# Altium schematic sheet TOP.SchDoc
size A4; SheetNumber: 1; SheetTotal: 9
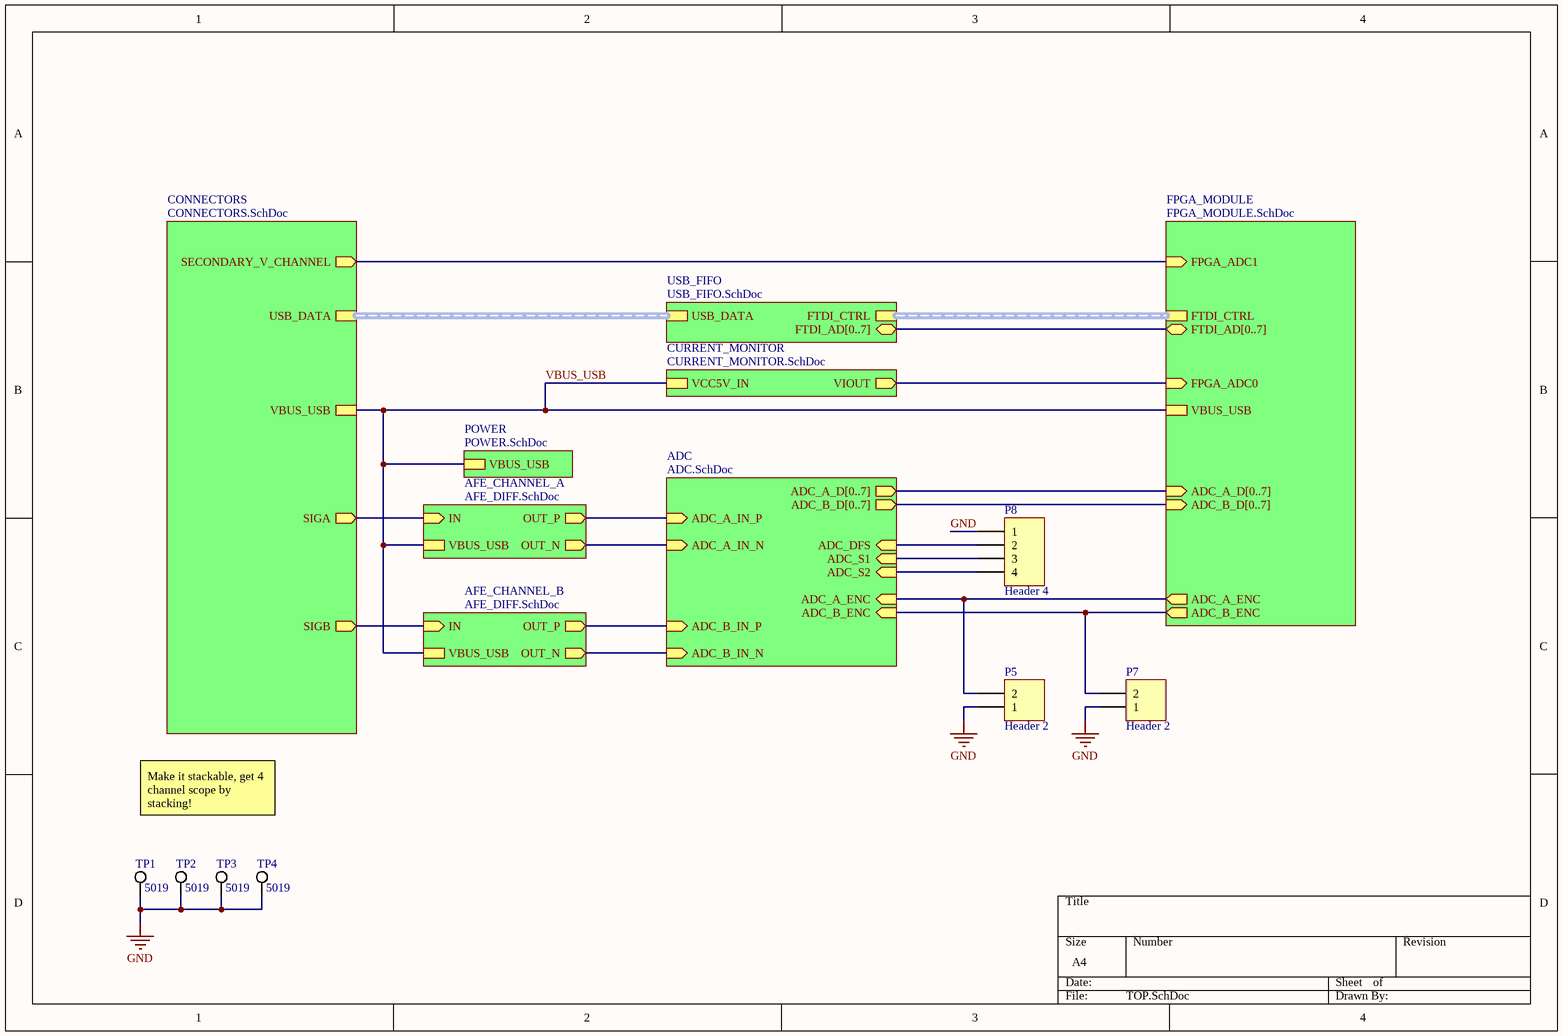
[diagram p0: TOP.SchDoc]

## Parts
P5  Header 2  [HDR1X2]
P7  Header 2  [HDR1X2]
P8  Header 4  [HDR1X4]
TP1  5019  [KSTN-5019_V]
TP2  5019  [KSTN-5019_V]
TP3  5019  [KSTN-5019_V]
TP4  5019  [KSTN-5019_V]

## Sub-sheets
ADC = ADC.SchDoc: ADC_A_IN_P (in), ADC_A_D[0..7] (out), ADC_A_ENC (in), ADC_B_IN_P (in), ADC_B_ENC (in), ADC_DFS (in), ADC_S1 (in), ADC_S2 (in), ADC_B_D[0..7] (out), ADC_A_IN_N (in), ADC_B_IN_N (in)
AFE_CHANNEL_A = AFE_DIFF.SchDoc: IN (in), OUT_P (out), OUT_N (out), VBUS_USB
AFE_CHANNEL_B = AFE_DIFF.SchDoc: IN (in), OUT_P (out), OUT_N (out), VBUS_USB
CONNECTORS = CONNECTORS.SchDoc: USB_DATA (harness USB_DATA), VBUS_USB, SIGA (out), SECONDARY_V_CHANNEL (out), SIGB (out)
CURRENT_MONITOR = CURRENT_MONITOR.SchDoc: VIOUT (out), VCC5V_IN
FPGA_MODULE = FPGA_MODULE.SchDoc: FTDI_CTRL (harness FTDI_CTRL), FTDI_AD[0..7] (bidir), VBUS_USB, ADC_A_D[0..7] (in), ADC_A_ENC (out), FPGA_ADC0 (in), FPGA_ADC1 (in), ADC_B_ENC (out), ADC_B_D[0..7] (in)
POWER = POWER.SchDoc: VBUS_USB
USB_FIFO = USB_FIFO.SchDoc: USB_DATA (harness USB_DATA), FTDI_CTRL (harness FTDI_CTRL), FTDI_AD[0..7] (bidir)

## Nets
GND: P5.1 P7.1 P8.1 TP1.1 TP2.1 TP3.1 TP4.1
VBUS_USB: sheet FPGA_MODULE/VBUS_USB, sheet CONNECTORS/VBUS_USB, sheet POWER/VBUS_USB, sheet AFE_CHANNEL_A/VBUS_USB, sheet CURRENT_MONITOR/VCC5V_IN, sheet AFE_CHANNEL_B/VBUS_USB
NetP5_2: P5.2 ; sheet FPGA_MODULE/ADC_A_ENC, sheet ADC/ADC_A_ENC
NetP7_2: P7.2 ; sheet FPGA_MODULE/ADC_B_ENC, sheet ADC/ADC_B_ENC
NetP8_2: P8.2 ; sheet ADC/ADC_DFS
NetP8_3: P8.3 ; sheet ADC/ADC_S1
NetP8_4: P8.4 ; sheet ADC/ADC_S2
(unnamed): sheet FPGA_MODULE/FPGA_ADC0, sheet CURRENT_MONITOR/VIOUT
(unnamed): sheet FPGA_MODULE/FPGA_ADC1, sheet CONNECTORS/SECONDARY_V_CHANNEL
(unnamed): sheet CONNECTORS/SIGA, sheet AFE_CHANNEL_A/IN
(unnamed): sheet CONNECTORS/SIGB, sheet AFE_CHANNEL_B/IN
(unnamed): sheet ADC/ADC_A_IN_P, sheet AFE_CHANNEL_A/OUT_P
(unnamed): sheet ADC/ADC_B_IN_P, sheet AFE_CHANNEL_B/OUT_P
(unnamed): sheet ADC/ADC_A_IN_N, sheet AFE_CHANNEL_A/OUT_N
(unnamed): sheet ADC/ADC_B_IN_N, sheet AFE_CHANNEL_B/OUT_N

## Buses and harness runs
bus sheet ADC/ADC_A_D[0..7] = sheet FPGA_MODULE/ADC_A_D[0..7]
bus sheet ADC/ADC_B_D[0..7] = sheet FPGA_MODULE/ADC_B_D[0..7]
bus sheet FPGA_MODULE/FTDI_AD[0..7] = sheet USB_FIFO/FTDI_AD[0..7]
harness sheet CONNECTORS/USB_DATA = sheet USB_FIFO/USB_DATA
harness sheet FPGA_MODULE/FTDI_CTRL = sheet USB_FIFO/FTDI_CTRL

## Notes on the sheet
- Make it stackable, get 4 channel scope by stacking!

## Library data of the parts
P5 P7 = Header 2: Header, 2-Pin; LatestRevisionDate: 17-Jul-2002; LatestRevisionNote: Re-released for DXP Platform.; Publisher: Altium Limited
P8 = Header 4: Header, 4-Pin; LatestRevisionDate: 17-Jul-2002; LatestRevisionNote: Re-released for DXP Platform.; Publisher: Altium Limited
TP1-TP4 = CMP-1672-00008-1: Test Point, 1 Position SMD, RoHS, Tape and Reel; ComponentLink1Description: Manufacturer URL; Package Quantity: 1000; DatasheetVersion: 03/2014; Packaging: Tape and Reel; ComponentLink2URL: http://www.keyelco.com/product-pdf.cfm?p=1357; ComponentLink1URL: http://www.keyelco.com/; Mount: Surface Mount; Contact Plating: Silver; PackageDescription: 1-Pin Surface Mount Device, Body 3.81 x 2.03 mm; Pins: 1; RoHSCompliant: True; Mounting Technology: Surface Mount; ComponentLink2Description: Datasheet; PackageReference: 5019